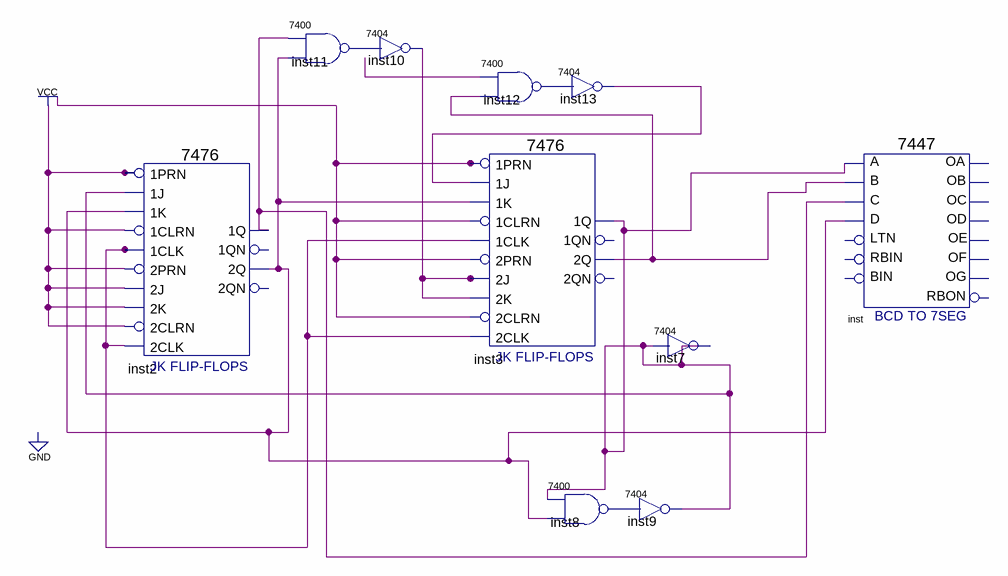
[diagram p0: schematic sheet]
// Quartus schematic lab 3 245.bdf as structural Verilog: 10 symbols, 0 pins
module \lab_3_245  (
);

  wire inst2_1q, inst2_2q, inst3_1q, inst3_2q, inst8_1, inst10_1, inst11_1, inst12_1, inst13_1, undriven,
       undriven_2, undriven_3;

  \7476  inst2 (
    .\1J (inst3_1q), .\1K (inst2_2q), .\1PRN (1'b1), .\2PRN (1'b1), .\2J (1'b1), .\1CLK (undriven_2),
    .\1CLRN (1'b1), .\2K (1'b1), .\2CLRN (1'b1), .\2CLK (undriven_2), .\1Q (inst2_1q), .\2Q (inst2_2q));  // open: 2QN, 1QN
  \7400  inst11 (.\3 (inst2_2q), .\2 (inst2_1q), .\1 (inst11_1));
  \7404  inst10 (.\2 (inst11_1), .\1 (inst10_1));
  \7400  inst12 (.\3 (inst3_2q), .\2 (undriven_3), .\1 (inst12_1));
  \7476  inst3 (
    .\1J (inst13_1), .\1K (inst2_2q), .\1PRN (undriven), .\2PRN (undriven), .\2J (inst10_1),
    .\1CLK (undriven_2), .\1CLRN (undriven), .\2K (inst10_1), .\2CLRN (undriven), .\2CLK (undriven_2),
    .\1Q (inst3_1q), .\2Q (inst3_2q));  // open: 2QN, 1QN
  \7404  inst13 (.\2 (inst12_1), .\1 (inst13_1));
  \7400  inst8 (.\3 (inst2_2q), .\2 (inst3_1q), .\1 (inst8_1));
  \7404  inst7 (.\2 (inst3_1q), .\1 (inst3_1q));
  \7404  inst9 (.\2 (inst8_1), .\1 (inst3_1q));
  \7447  inst (
    .B(inst3_2q), .C(inst2_1q), .D(inst2_2q), .A(inst3_1q));  // open: LTN, RBIN, BIN, OB, OC, OE, OD, OF, OG, OA, RBON
endmodule
